# EasyEDA schematic PCB LEDs GPIO servicios_2021-05-17.json
TITLE: Proyecto final, indicar servicios activos con LEDs; REV: 1.0; Date: 2021-05-17; Sheet: 1/1; Drawn By: RUBEN MELLADO CULEBRAS; Company: IES Serpis - GS ASIR
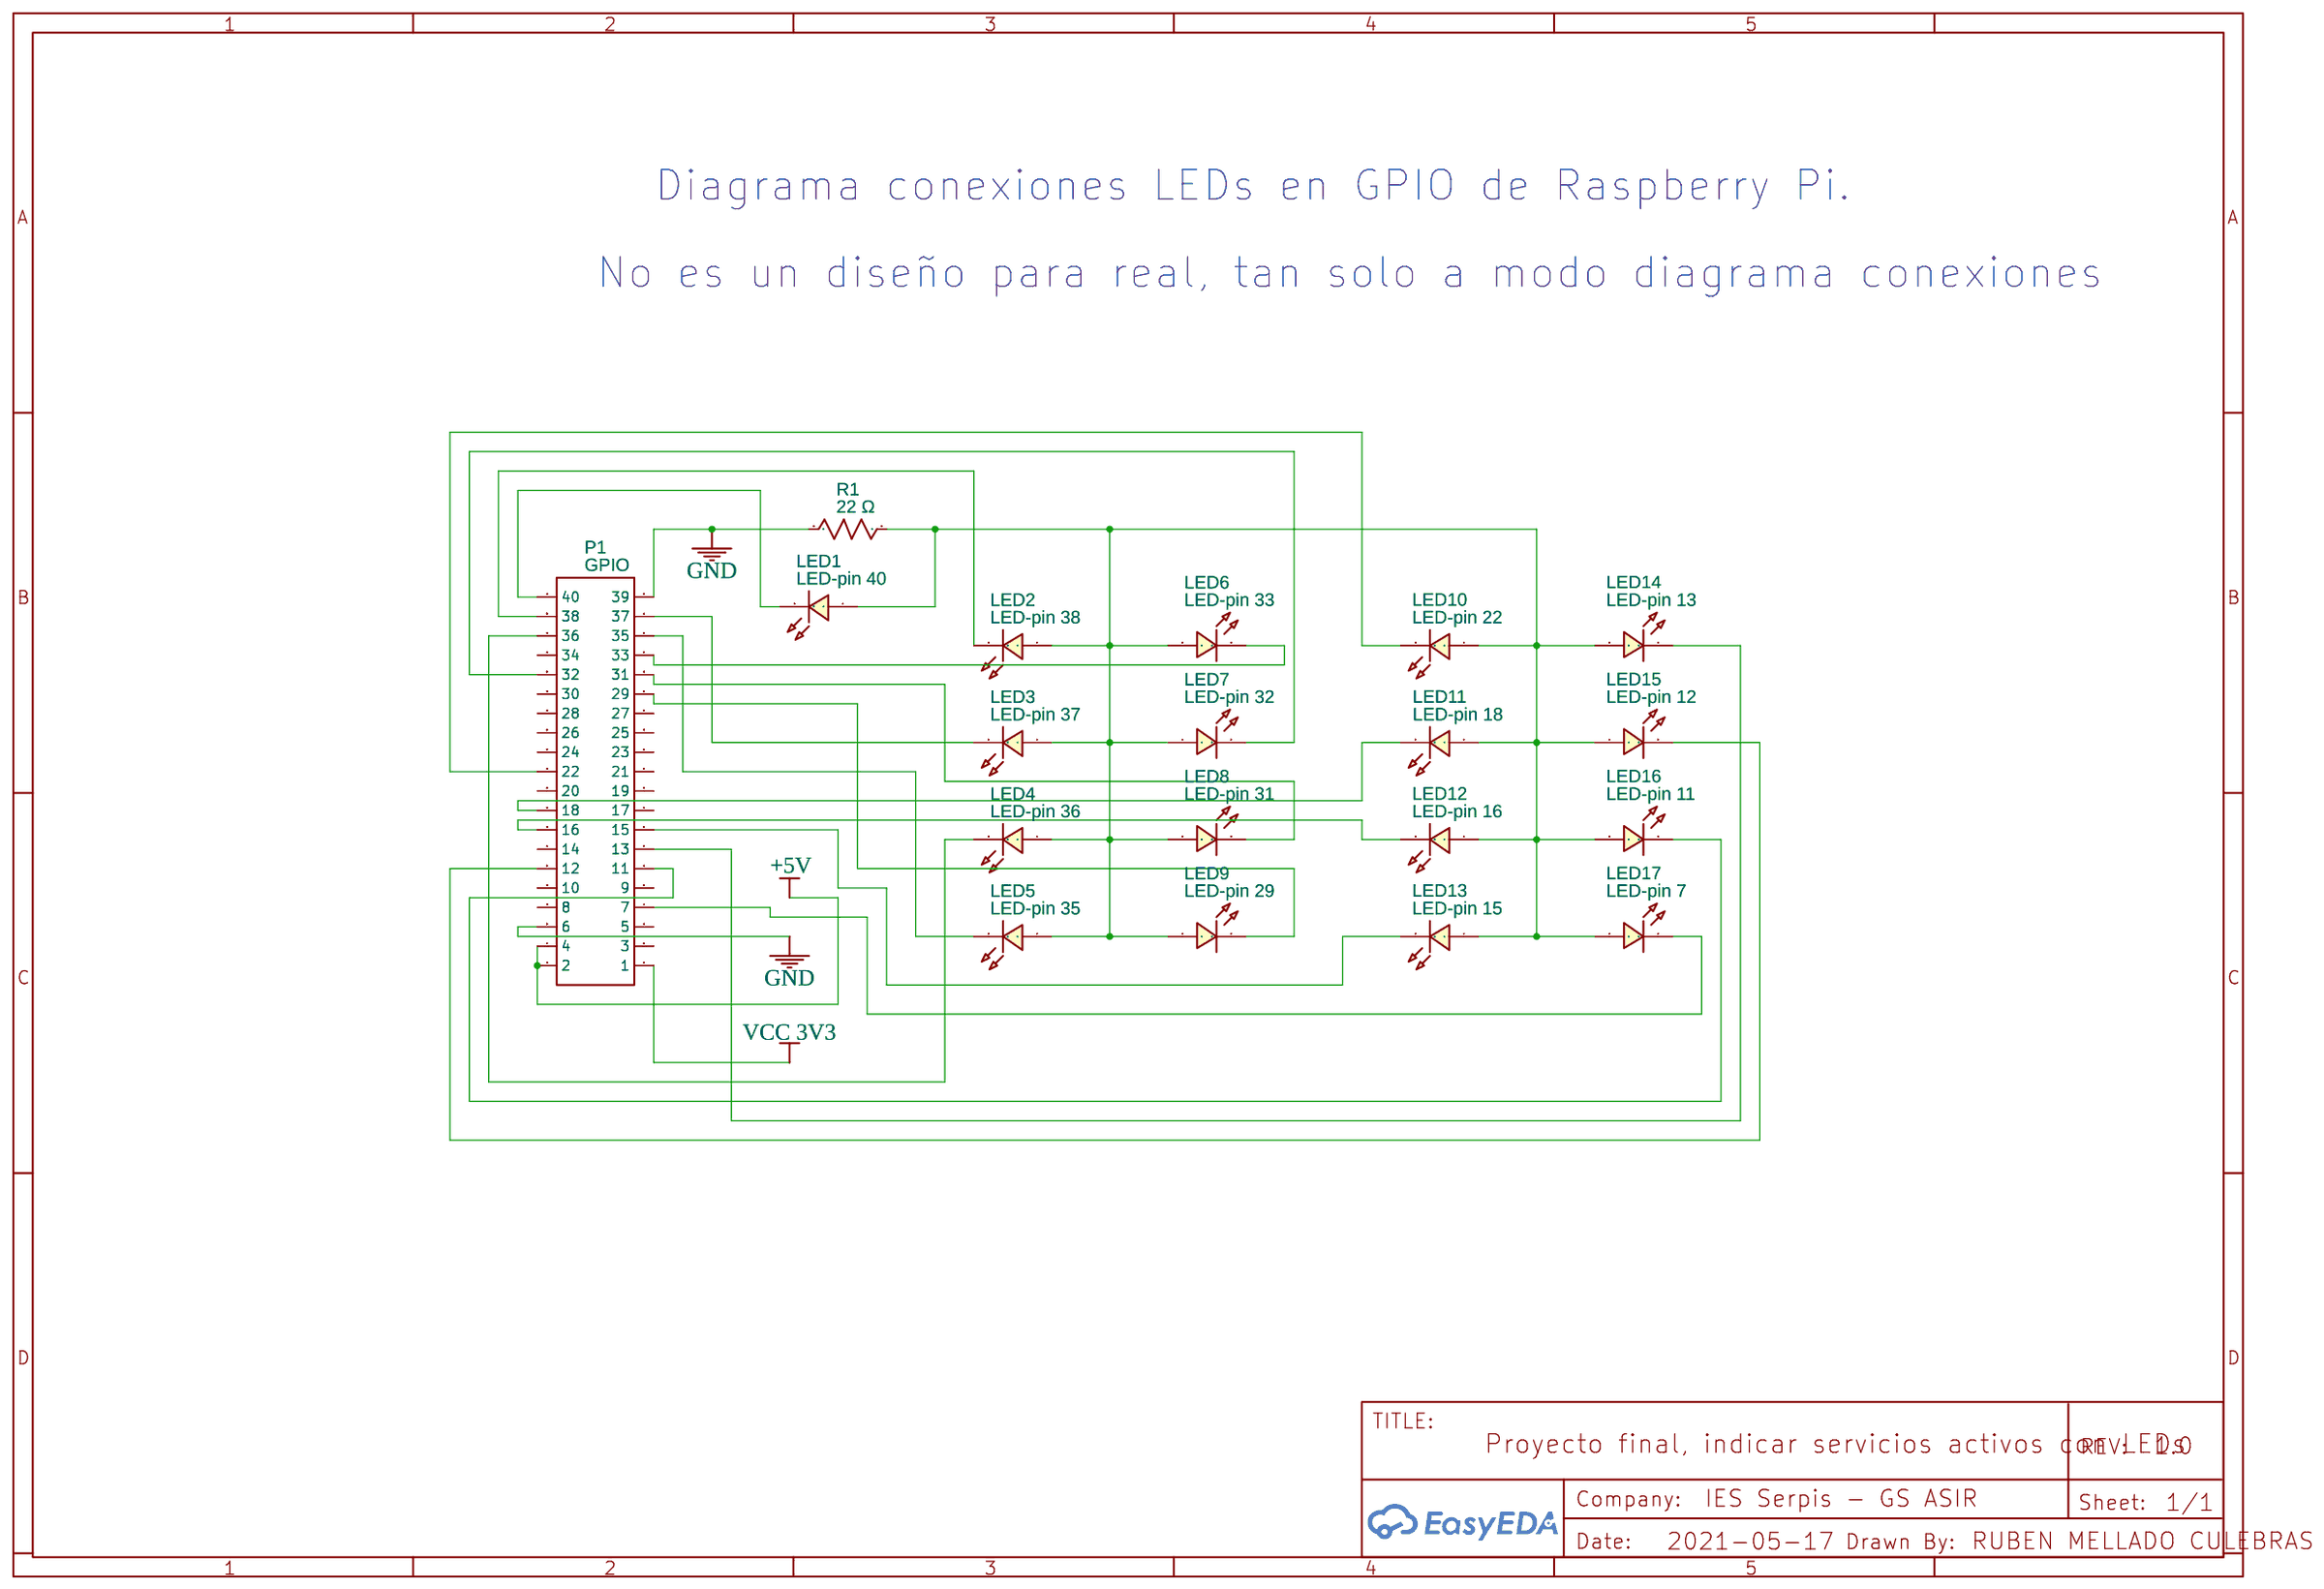
[diagram p0: schematic sheet]

## Parts
LED1  LED-pin 40  [LED0603_RED]
LED2  LED-pin 38  [LED0603_RED]
LED3  LED-pin 37  [LED0603_RED]
LED4  LED-pin 36  [LED0603_RED]
LED5  LED-pin 35  [LED0603_RED]
LED6  LED-pin 33  [LED0603_RED]
LED7  LED-pin 32  [LED0603_RED]
LED8  LED-pin 31  [LED0603_RED]
LED9  LED-pin 29  [LED0603_RED]
LED10  LED-pin 22  [LED0603_RED]
LED11  LED-pin 18  [LED0603_RED]
LED12  LED-pin 16  [LED0603_RED]
LED13  LED-pin 15  [LED0603_RED]
LED14  LED-pin 13  [LED0603_RED]
LED15  LED-pin 12  [LED0603_RED]
LED16  LED-pin 11  [LED0603_RED]
LED17  LED-pin 7  [LED0603_RED]
P1  GPIO  [IDC-TH_40P-P2.54_C9138]
R1  22 Ω  [R0603]

## Library data of the parts
LED1-LED17 = LED-0603_R: Manufacturer: EVERLIGHT(台湾亿光); Manufacturer Part: 19-217/R6C-AL1M2VY/3T; Supplier Part: C72044; Supplier: LCSC; Contributor: LCEDA_01
P1 = HDR-IDC-2.54-2X20P: Supplier: LCSC; Manufacturer: BOOMELE; Manufacturer Part: IDC Box 2X20 2.54MM; image: //image.lceda.cn/szlcsc/C9138.jpg; Supplier Part: C9138
R1 = R_0603_US: Contributor: LCEDA_Lib

## Nets
+5V: P1.2 P1.4
GND: P1.6 P1.39 R1.1
VCC 3V3: P1.1
Net-(LED1-1): LED1.1 LED2.1 LED3.1 LED4.1 LED5.1 LED6.1 LED7.1 LED8.1 LED9.1 LED10.1 LED11.1 LED12.1 LED13.1 LED14.1 LED15.1 LED16.1 LED17.1 R1.2
Net-(LED1-2): LED1.2 P1.40
Net-(LED2-2): LED2.2 P1.38
Net-(LED3-2): LED3.2 P1.37
Net-(LED4-2): LED4.2 P1.36
Net-(LED5-2): LED5.2 P1.35
Net-(LED6-2): LED6.2 P1.33
Net-(LED7-2): LED7.2 P1.32
Net-(LED8-2): LED8.2 P1.31
Net-(LED9-2): LED9.2 P1.29
Net-(LED10-2): LED10.2 P1.22
Net-(LED11-2): LED11.2 P1.18
Net-(LED12-2): LED12.2 P1.16
Net-(LED13-2): LED13.2 P1.15
Net-(LED14-2): LED14.2 P1.13
Net-(LED15-2): LED15.2 P1.12
Net-(LED16-2): LED16.2 P1.11
Net-(LED17-2): LED17.2 P1.7

Not connected (* = marked no-connect by the designer): P1 3 5 8 9 10 14 17 19 20 21 23 24 25 26 27 28 30 34

## Notes on the sheet
- Diagrama conexiones LEDs en GPIO de Raspberry Pi.
- No es un diseño para real, tan solo a modo diagrama conexiones
